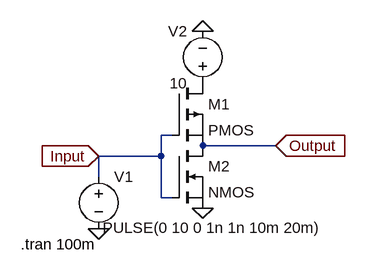
[diagram p0: schematic cmos_inverter.asc]
cmos_inverter.asc, the LTspice schematic file:
Version 4.1
SHEET 1 880 680
WIRE 144 144 128 144
WIRE 304 160 192 160
WIRE 128 176 128 144
WIRE 128 176 32 176
WIRE 32 208 32 176
WIRE 128 240 128 176
WIRE 144 240 128 240
FLAG 304 160 Output
IOPIN 304 160 In
FLAG 32 176 Input
IOPIN 32 176 In
FLAG 32 288 0
FLAG 192 256 0
FLAG 192 -16 0
SYMBOL pmos 144 64 R0
SYMATTR InstName M1
SYMBOL nmos 144 160 R0
SYMATTR InstName M2
SYMBOL voltage 32 192 R0
WINDOW 3 175 110 Bottom 2
WINDOW 123 0 0 Left 0
WINDOW 39 0 0 Left 0
SYMATTR InstName V1
SYMATTR Value PULSE(0 10 0 1n 1n 10m 20m)
SYMBOL voltage 192 80 R180
WINDOW 0 24 96 Left 2
WINDOW 3 24 16 Left 2
WINDOW 123 0 0 Left 0
WINDOW 39 0 0 Left 0
SYMATTR InstName V2
SYMATTR Value 10
TEXT -88 312 Left 2 !.tran 100m

The netlist it stands for:
* cmos_inverter.asc
M1 P001 Input Output Output PMOS
M2 Output Input 0 0 NMOS
V1 Input 0 PULSE(0 10 0 1n 1n 10m 20m)
V2 P001 0 10
.model NMOS NMOS
.model PMOS PMOS
.lib standard.mos
.tran 100m
.backanno
.end